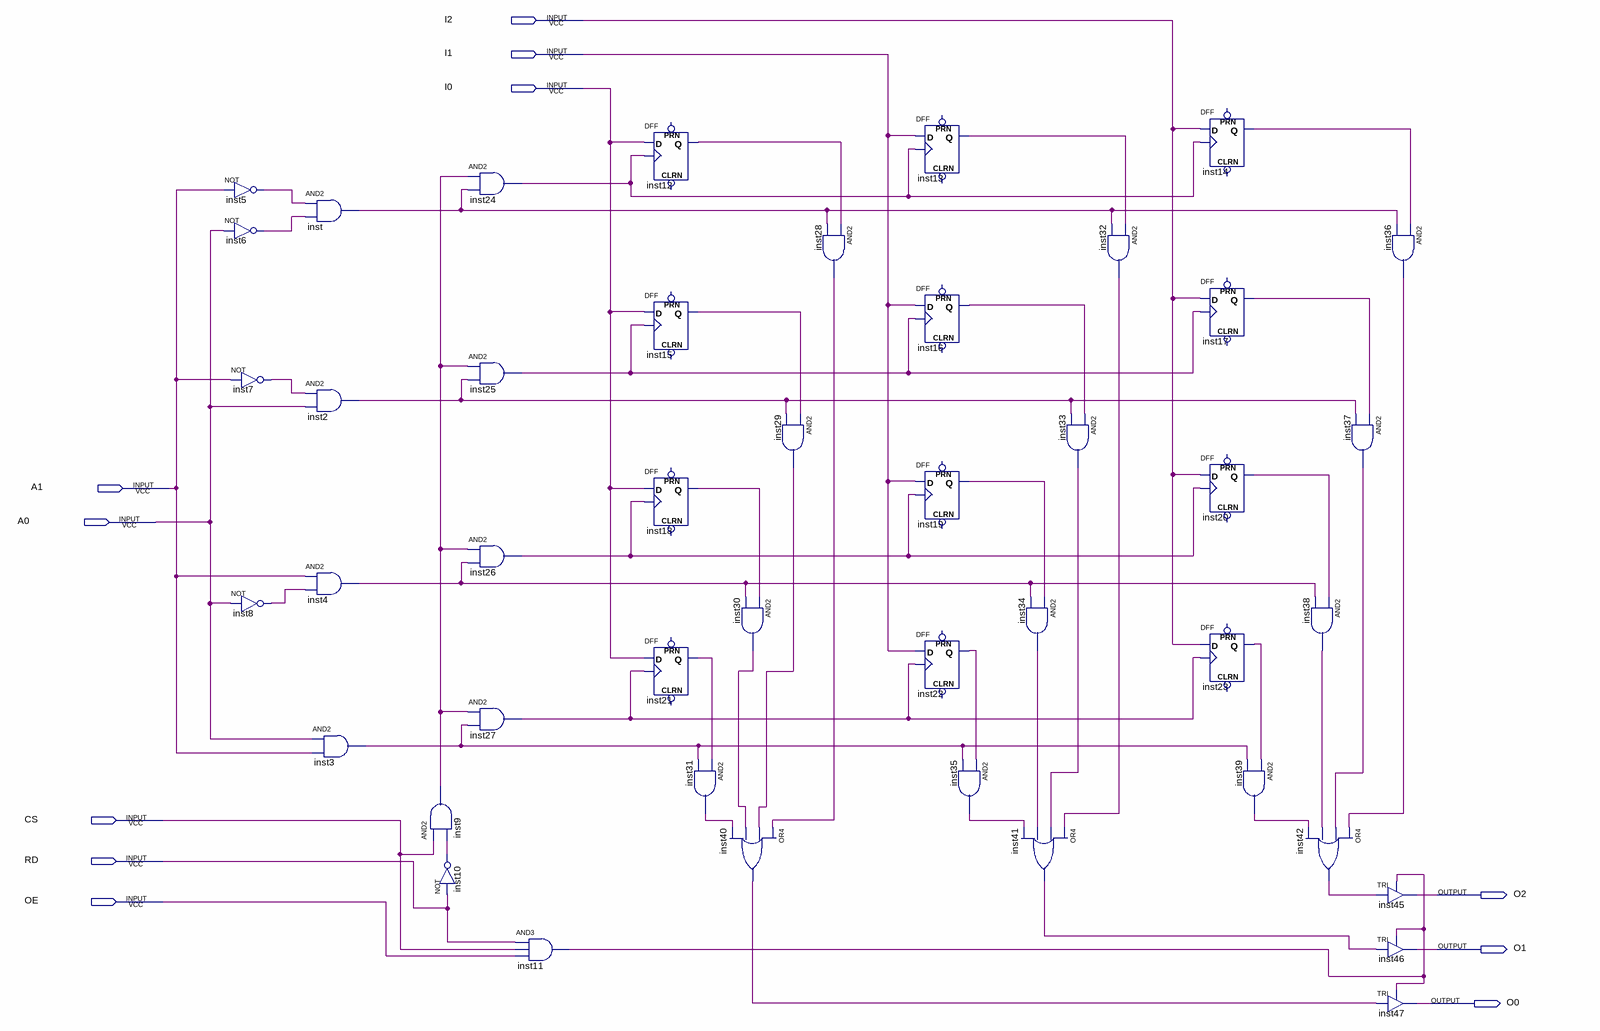
[diagram p0: schematic sheet]
// Quartus schematic Memory.bdf as structural Verilog: 45 symbols, 11 pins
module Memory (
  input  I2,
  input  I1,
  input  I0,
  input  A1,
  input  A0,
  input  CS,
  input  RD,
  input  OE,
  output O2,
  output O1,
  output O0
);

  wire inst2_out, inst3_out, inst4_out, inst5_out, inst6_out, inst7_out, inst8_out, inst9_out, inst10_out,
       inst11_out, inst12_q, inst13_q, inst14_q, inst15_q, inst16_q, inst17_q, inst18_q, inst19_q, inst20_q,
       inst21_q, inst22_q, inst23_q, inst24_out, inst25_out, inst26_out, inst27_out, inst28_out, inst29_out,
       inst30_out, inst31_out, inst32_out, inst33_out, inst34_out, inst35_out, inst36_out, inst37_out,
       inst38_out, inst39_out, inst40_out, inst41_out, inst42_out, inst_out;

  not inst5 (inst5_out, A1);
  not inst6 (inst6_out, A0);
  not inst7 (inst7_out, A1);
  not inst8 (inst8_out, A0);
  and inst (inst_out, inst5_out, inst6_out);
  and inst2 (inst2_out, inst7_out, A0);
  and inst4 (inst4_out, A1, inst8_out);
  and inst3 (inst3_out, A0, A1);
  and inst9 (inst9_out, CS, inst10_out);
  and inst24 (inst24_out, inst9_out, inst_out);
  and inst25 (inst25_out, inst9_out, inst2_out);
  and inst26 (inst26_out, inst9_out, inst4_out);
  and inst27 (inst27_out, inst9_out, inst3_out);
  not inst10 (inst10_out, RD);
  and inst11 (inst11_out, RD, CS, OE);
  DFF inst12 (.CLK(inst24_out), .D(I0), .Q(inst12_q));  // open: CLRN, PRN
  DFF inst15 (.CLK(inst25_out), .D(I0), .Q(inst15_q));  // open: CLRN, PRN
  DFF inst18 (.CLK(inst26_out), .D(I0), .Q(inst18_q));  // open: CLRN, PRN
  DFF inst21 (.CLK(inst27_out), .D(I0), .Q(inst21_q));  // open: CLRN, PRN
  and inst31 (inst31_out, inst21_q, inst3_out);
  and inst30 (inst30_out, inst18_q, inst4_out);
  or inst40 (inst40_out, inst28_out, inst29_out, inst30_out, inst31_out);
  and inst29 (inst29_out, inst15_q, inst2_out);
  and inst28 (inst28_out, inst12_q, inst_out);
  DFF inst13 (.CLK(inst24_out), .D(I1), .Q(inst13_q));  // open: CLRN, PRN
  DFF inst16 (.CLK(inst25_out), .D(I1), .Q(inst16_q));  // open: CLRN, PRN
  DFF inst19 (.CLK(inst26_out), .D(I1), .Q(inst19_q));  // open: CLRN, PRN
  DFF inst22 (.CLK(inst27_out), .D(I1), .Q(inst22_q));  // open: CLRN, PRN
  and inst35 (inst35_out, inst22_q, inst3_out);
  and inst34 (inst34_out, inst19_q, inst4_out);
  or inst41 (inst41_out, inst32_out, inst33_out, inst34_out, inst35_out);
  and inst33 (inst33_out, inst16_q, inst2_out);
  and inst32 (inst32_out, inst13_q, inst_out);
  DFF inst14 (.CLK(inst24_out), .D(I2), .Q(inst14_q));  // open: CLRN, PRN
  DFF inst17 (.CLK(inst25_out), .D(I2), .Q(inst17_q));  // open: CLRN, PRN
  DFF inst20 (.CLK(inst26_out), .D(I2), .Q(inst20_q));  // open: CLRN, PRN
  DFF inst23 (.CLK(inst27_out), .D(I2), .Q(inst23_q));  // open: CLRN, PRN
  and inst39 (inst39_out, inst23_q, inst3_out);
  and inst37 (inst37_out, inst17_q, inst2_out);
  and inst38 (inst38_out, inst20_q, inst4_out);
  or inst42 (inst42_out, inst36_out, inst37_out, inst38_out, inst39_out);
  and inst36 (inst36_out, inst14_q, inst_out);
  TRI inst45 (.IN(inst42_out), .OE(inst11_out), .OUT(O2));
  TRI inst46 (.IN(inst41_out), .OE(inst11_out), .OUT(O1));
  TRI inst47 (.IN(inst40_out), .OE(inst11_out), .OUT(O0));
endmodule
